# EAGLE schematic Controller-Board_Rack-PDU_2.0 (EAGLE 9.2.1)

## Sheet 1 of 2: MICROCONTROLLER
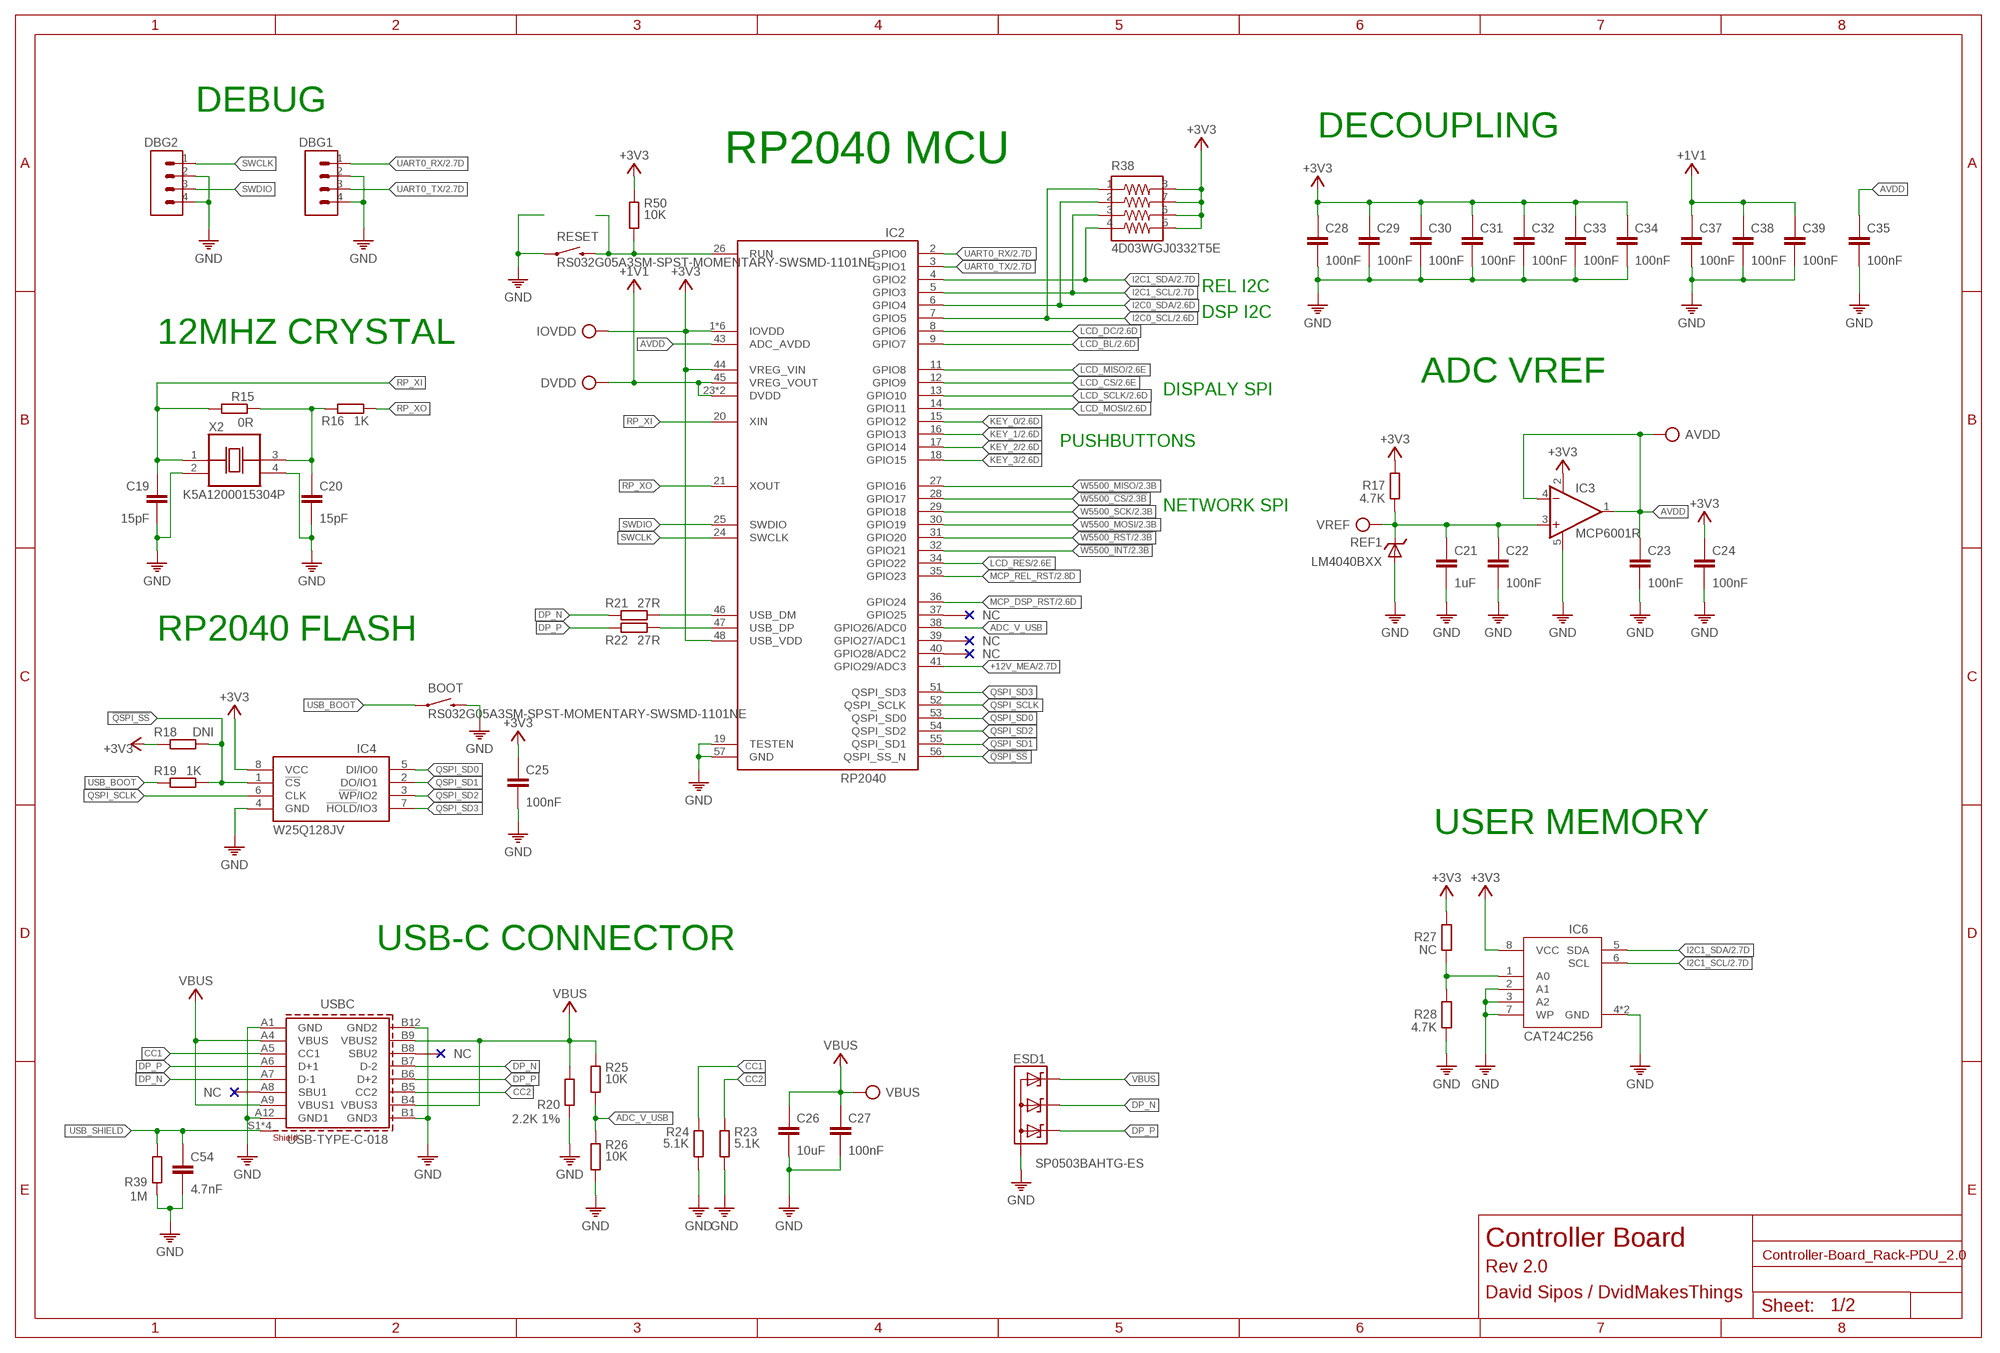
[diagram p0: schematic, sheet 1]

### Parts
AVDD  TP  [TP]
BOOT  RS032G05A3SM-SPST-MOMENTARY-SWSMD-1101NE  [TACTILE-SWITCH-1101NE]
C19  15pF  C-0402  [C0402]
C20  15pF  C-0402  [C0402]
C21  1uF  C-0402  [C0402]
C22  100nF  C-0402  [C0402]
C23  100nF  C-0402  [C0402]
C24  100nF  C-0402  [C0402]
C25  100nF  C-0402  [C0402]
C26  10uF  C0805  [0805]
C27  100nF  C0402  [0402]
C28  100nF  C-0402  [C0402]
C29  100nF  C-0402  [C0402]
C30  100nF  C-0402  [C0402]
C31  100nF  C-0402  [C0402]
C32  100nF  C-0402  [C0402]
C33  100nF  C-0402  [C0402]
C34  100nF  C-0402  [C0402]
C35  100nF  C-0402  [C0402]
C37  100nF  C-0402  [C0402]
C38  100nF  C-0402  [C0402]
C39  100nF  C-0402  [C0402]
C54  4.7nF  C0402  [0402]
DBG1  CON-1X4  [1X4]
DBG2  CON-1X4  [1X4]
DVDD  TP  [TP]
ESD1  SP0503BAHTG-ES  SP0503BAHT  [SOT143]
IC2  RP2040  [QFN40P700X700X100-57T510]
IC3  MCP6001R  MCP6001RT  [SOT23-5]
IC4  W25Q128JVPIQ  W25Q128JVP  [SON127P600X500X75-8N]
IC6  CAT24C512HU5IGT3  CAT24C256-HU4  [SON50P300X200X50-9T130X140N]
IOVDD  TP  [TP]
R15  0R  R0402  [0402]
R16  1K  R0402  [0402]
R17  4.7K  R0402  [0402]
R18  DNI  R0402  [0402]
R19  1K  R0402  [0402]
R20  2.2K 1%  R0402  [0402]
R21  27R  R0402  [0402]
R22  27R  R0402  [0402]
R23  5.1K  R0402  [0402]
R24  5.1K  R0402  [0402]
R25  10K  R0402  [0402]
R26  10K  R0402  [0402]
R27  NC  R0402  [0402]
R28  4.7K  R0402  [0402]
R38  4D03WGJ0332T5E  742C083103JP  [742C083103JP]
R39  1M  R0402  [0402]
R50  10K  R0402  [0402]
REF1  LM4040BXX  [SOT23]
RESET  RS032G05A3SM-SPST-MOMENTARY-SWSMD-1101NE  [TACTILE-SWITCH-1101NE]
USBC  USB-TYPE-C-018  629722000214  [629722000214]
VBUS  TP  [TP]
VREF  TP  [TP]
X2  K5A1200015304P  CRYSTAL  [OSCCC500X320X130]

### Nets
!QSPI_SS: IC2.56(QSPI_SS_N) IC4.1(!CS) R18.1 R19.2
!W5500_CS: IC2.28(GPIO17) ; also sheet 2
!W5500_INT: IC2.32(GPIO21) ; also sheet 2
!W5500_RST: IC2.31(GPIO20) ; also sheet 2
+1V1: C37.1 C38.1 C39.1 DVDD.TP IC2.23(DVDD) IC2.45(VREG_VOUT) IC2.50(DVDD)
+3V3: C24.1 C25.1 C28.1 C29.1 C30.1 C31.1 C32.1 C33.1 C34.1 IC2.1(IOVDD) IC2.10(IOVDD) IC2.22(IOVDD) IC2.33(IOVDD) IC2.42(IOVDD) IC2.44(VREG_VIN) IC2.48(USB_VDD) IC2.49(IOVDD) IC3.2(V+) IC4.8(VCC) IC6.8(VCC) IOVDD.TP R17.2 R18.2 R27.2 R38.5 R38.6 R38.7 R38.8 R50.1 ; also sheet 2
+12V_MEA: IC2.41(GPIO29/ADC3) ; also sheet 2
ADC_V_USB: IC2.38(GPIO26/ADC0) R25.2 R26.1
AVDD: AVDD.TP C23.1 C35.1 IC2.43(ADC_AVDD) IC3.1(OUT) IC3.4(-IN)
CC1: R24.1 USBC.A5(CC1)
CC2: R23.1 USBC.B5(CC2)
DP_N [90R_DIFFPAIR]: ESD1.3(C2) R21.1 USBC.A7(D-1) USBC.B7(D-2)
DP_P [90R_DIFFPAIR]: ESD1.2(C1) R22.1 USBC.A6(D+1) USBC.B6(D+2)
GND: BOOT.2 C19.2 C20.2 C21.2 C22.2 C23.2 C24.2 C25.2 C26.2 C27.2 C28.2 C29.2 C30.2 C31.2 C32.2 C33.2 C34.2 C35.2 C37.2 C38.2 C39.2 C54.2 DBG1.2 DBG1.4 DBG2.2 DBG2.4 ESD1.1(A) IC2.19(TESTEN) IC2.57(GND) IC3.5(V-) IC4.4(GND) IC6.2(A1) IC6.3(A2) IC6.4(GND) IC6.7(WP) IC6.9(GND) R20.2 R23.2 R24.2 R26.2 R28.1 R39.2 REF1.2(A) REF1.3(A) RESET.1 USBC.A1(GND) USBC.A12(GND1) USBC.B1(GND3) USBC.B12(GND2) X2.2(VSS) X2.4(VDD) ; also sheet 2
I2C0_SCL: IC2.7(GPIO5) R38.1 ; also sheet 2
I2C0_SDA: IC2.6(GPIO4) R38.2 ; also sheet 2
I2C1_SCL: IC2.5(GPIO3) IC6.6(SCL) R38.3 ; also sheet 2
I2C1_SDA: IC2.4(GPIO2) IC6.5(SDA) R38.4 ; also sheet 2
KEY_0: IC2.15(GPIO12) ; also sheet 2
KEY_1: IC2.16(GPIO13) ; also sheet 2
KEY_2: IC2.17(GPIO14) ; also sheet 2
KEY_3: IC2.18(GPIO15) ; also sheet 2
LCD_BL: IC2.9(GPIO7) ; also sheet 2
LCD_CS: IC2.12(GPIO9) ; also sheet 2
LCD_DC: IC2.8(GPIO6) ; also sheet 2
LCD_MISO: IC2.11(GPIO8) ; also sheet 2
LCD_MOSI: IC2.14(GPIO11) ; also sheet 2
LCD_RES: IC2.34(GPIO22) ; also sheet 2
LCD_SCLK: IC2.13(GPIO10) ; also sheet 2
MCP_DSP_RST: IC2.36(GPIO24) ; also sheet 2
MCP_REL_RST: IC2.35(GPIO23) ; also sheet 2
N$14: C20.1 R15.2 R16.1 X2.3(OUT)
N$17: IC2.26(RUN) R50.2 RESET.2
N$23: IC6.1(A0) R27.1 R28.2
QSPI_SCLK: IC2.52(QSPI_SCLK) IC4.6(CLK)
QSPI_SD0: IC2.53(QSPI_SD0) IC4.5(DI/IO0)
QSPI_SD1: IC2.55(QSPI_SD1) IC4.2(DO/IO1)
QSPI_SD2: IC2.54(QSPI_SD2) IC4.3(!WP!/IO2)
QSPI_SD3: IC2.51(QSPI_SD3) IC4.7(!HOLD!/IO3)
RP_XI: C19.1 IC2.20(XIN) R15.1 X2.1(CON)
RP_XO: IC2.21(XOUT) R16.2
SWCLK: DBG2.1 IC2.24(SWCLK)
SWDIO: DBG2.3 IC2.25(SWDIO)
UART0_RX: DBG1.1 IC2.2(GPIO0) ; also sheet 2
UART0_TX: DBG1.3 IC2.3(GPIO1) ; also sheet 2
USB_BOOT: BOOT.1 R19.1
USB_DP_N [90R_DIFFPAIR]: IC2.46(USB_DM) R21.2
USB_DP_P [90R_DIFFPAIR]: IC2.47(USB_DP) R22.2
USB_SHIELD: C54.1 R39.1 USBC.S1(SHIELD) USBC.S2(SHIELD) USBC.S3(SHIELD) USBC.S4(SHIELD)
VBUS: C26.1 C27.1 ESD1.4(C3) R20.1 R25.1 USBC.A4(VBUS) USBC.A9(VBUS1) USBC.B4(VBUS3) USBC.B9(VBUS2) VBUS.TP ; also sheet 2
VREF: C21.1 C22.1 IC3.3(+IN) R17.1 REF1.1(C) VREF.TP
W5500_MISO: IC2.27(GPIO16) ; also sheet 2
W5500_MOSI: IC2.30(GPIO19) ; also sheet 2
W5500_SCK: IC2.29(GPIO18) ; also sheet 2
Unconnected: IC2.37(GPIO25) IC2.39(GPIO27/ADC1) IC2.40(GPIO28/ADC2) USBC.A8(SBU1) USBC.B8(SBU2)

### Notes on the sheet
- DEBUG
- DECOUPLING
- RP2040 MCU
- REL I2C
- DSP I2C
- 12MHZ CRYSTAL
- ADC VREF
- DISPALY SPI
- PUSHBUTTONS
- NETWORK SPI
- RP2040 FLASH
- USER MEMORY
- USB-C CONNECTOR
- Controller Board
- Rev 2.0
- David Sipos / DvidMakesThings

## Sheet 2 of 2: NETWORK AND CONNECTORS
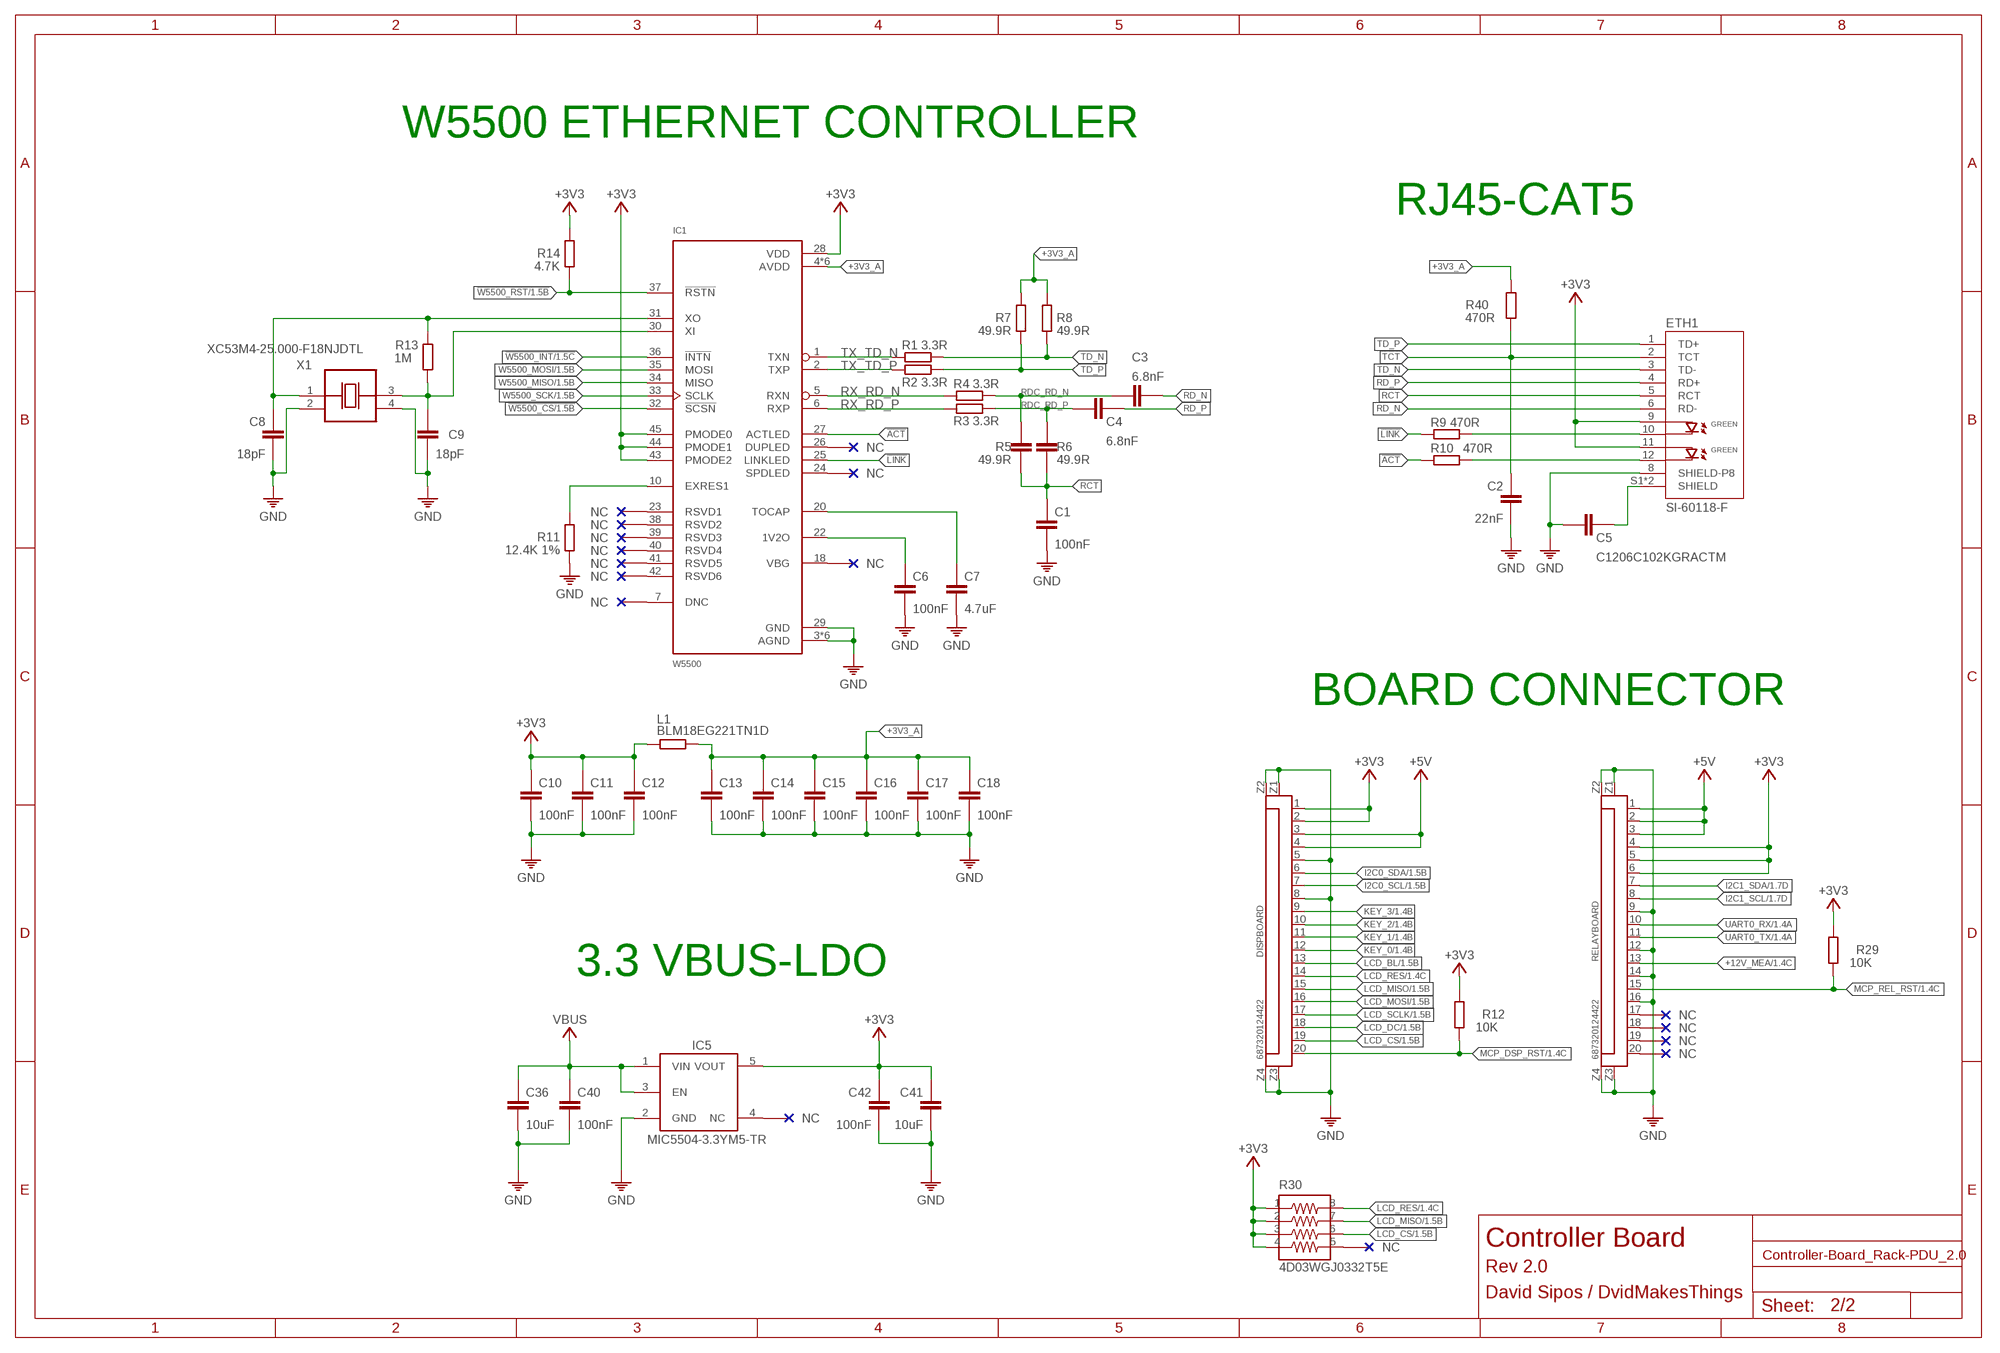
[diagram p1: schematic, sheet 2]

### Parts
C1  100nF  C-0402  [C0402]
C2  22nF  C-0402  [C0402]
C3  6.8nF  C-0402  [C0402]
C4  6.8nF  C-0402  [C0402]
C5  C1206C102KGRACTM  C-1206  [C1206]
C6  100nF  C-0402  [C0402]
C7  4.7uF  C-0402  [C0402]
C8  18pF  C-0402  [C0402]
C9  18pF  C-0402  [C0402]
C10  100nF  C-0402  [C0402]
C11  100nF  C-0402  [C0402]
C12  100nF  C-0402  [C0402]
C13  100nF  C-0402  [C0402]
C14  100nF  C-0402  [C0402]
C15  100nF  C-0402  [C0402]
C16  100nF  C-0402  [C0402]
C17  100nF  C-0402  [C0402]
C18  100nF  C-0402  [C0402]
C36  10uF  C0805  [0805]
C40  100nF  C0402  [0402]
C41  10uF  C0805  [0805]
C42  100nF  C0402  [0402]
DISPBOARD  687320124422  6873XX124422_687320124422  [687320124422]
ETH1  SI-60118-F  RJ45-CAT5  [RJ45-CAT5]
IC1  W5500  [LQFP48]
IC5  MIC5504-3.3YM5-TR  [SOT23-5]
L1  BLM18EG221TN1D  R0603  [0603]
R1  3.3R  R0402  [0402]
R2  3.3R  R0402  [0402]
R3  3.3R  R0402  [0402]
R4  3.3R  R0402  [0402]
R5  49.9R  C-0402  [C0402]
R6  49.9R  C-0402  [C0402]
R7  49.9R  R0402  [0402]
R8  49.9R  R0402  [0402]
R9  470R  R0402  [0402]
R10  470R  R0402  [0402]
R11  12.4K 1%  R0402  [0402]
R12  10K  R0402  [0402]
R13  1M  R0402  [0402]
R14  4.7K  R0402  [0402]
R29  10K  R0402  [0402]
R30  4D03WGJ0332T5E  742C083103JP  [742C083103JP]
R40  470R  R0402  [0402]
RELAYBOARD  687320124422  6873XX124422_687320124422  [687320124422]
X1  XC53M4-25.000-F18NJDTL  CRYSTAL  [OSCCC500X320X130]

### Nets
!ACT: IC1.27(ACTLED) R10.1
!LINK: IC1.25(LINKLED) R9.1
!W5500_CS: IC1.32(!SCSN) ; also sheet 1
!W5500_INT: IC1.36(!INTN) ; also sheet 1
!W5500_RST: IC1.37(!RSTN) R14.1 ; also sheet 1
+3V3: C10.1 C11.1 C12.1 C41.1 C42.1 DISPBOARD.1 DISPBOARD.2 ETH1.9(GA1) ETH1.11(GA2) IC1.28(VDD) IC1.43(PMODE2) IC1.44(PMODE1) IC1.45(PMODE0) IC5.5(VOUT) L1.1 R12.2 R14.2 R29.2 R30.1 R30.2 R30.3 R30.4 RELAYBOARD.4 RELAYBOARD.5 RELAYBOARD.6 ; also sheet 1
+3V3_A: C13.1 C14.1 C15.1 C16.1 C17.1 C18.1 IC1.4(AVDD) IC1.8(AVDD) IC1.11(AVDD) IC1.15(AVDD) IC1.17(AVDD) IC1.21(AVDD) L1.2 R7.2 R8.2 R40.2
+5V: DISPBOARD.3 DISPBOARD.4 RELAYBOARD.1 RELAYBOARD.2 RELAYBOARD.3
+12V_MEA: RELAYBOARD.13 ; also sheet 1
CHASSIS: C5.2 ETH1.S1(SHIELD) ETH1.S2(SHIELD)
GND: C1.2 C2.2 C5.1 C6.2 C7.2 C8.2 C9.2 C10.2 C11.2 C12.2 C13.2 C14.2 C15.2 C16.2 C17.2 C18.2 C36.2 C40.2 C41.2 C42.2 DISPBOARD.5 DISPBOARD.8 DISPBOARD.Z1 DISPBOARD.Z2 DISPBOARD.Z3 DISPBOARD.Z4 ETH1.8(SHIELD-P8) IC1.3(AGND) IC1.9(AGND) IC1.14(AGND) IC1.16(AGND) IC1.19(AGND) IC1.29(GND) IC1.48(AGND) IC5.2(GND) R11.1 RELAYBOARD.9 RELAYBOARD.12 RELAYBOARD.14 RELAYBOARD.16 RELAYBOARD.Z1 RELAYBOARD.Z2 RELAYBOARD.Z3 RELAYBOARD.Z4 X1.2(VSS) X1.4(VDD) ; also sheet 1
I2C0_SCL: DISPBOARD.7 ; also sheet 1
I2C0_SDA: DISPBOARD.6 ; also sheet 1
I2C1_SCL: RELAYBOARD.8 ; also sheet 1
I2C1_SDA: RELAYBOARD.7 ; also sheet 1
KEY_0: DISPBOARD.12 ; also sheet 1
KEY_1: DISPBOARD.11 ; also sheet 1
KEY_2: DISPBOARD.10 ; also sheet 1
KEY_3: DISPBOARD.9 ; also sheet 1
LCD_BL: DISPBOARD.13 ; also sheet 1
LCD_CS: DISPBOARD.19 R30.6 ; also sheet 1
LCD_DC: DISPBOARD.18 ; also sheet 1
LCD_MISO: DISPBOARD.15 R30.7 ; also sheet 1
LCD_MOSI: DISPBOARD.16 ; also sheet 1
LCD_RES: DISPBOARD.14 R30.8 ; also sheet 1
LCD_SCLK: DISPBOARD.17 ; also sheet 1
MCP_DSP_RST: DISPBOARD.20 R12.1 ; also sheet 1
MCP_REL_RST: R29.1 RELAYBOARD.15 ; also sheet 1
N$1: IC1.10(EXRES1) R11.2
N$2: ETH1.10(GK1) R9.2
N$3: ETH1.12(GK2) R10.2
N$4: C6.1 IC1.22(1V2O)
N$5: C7.1 IC1.20(TOCAP)
N$7: C9.1 IC1.30(XI) R13.1 X1.3(OUT)
RCT: C1.1 ETH1.5(RCT) R5.1 R6.1
RD_N [100R_DIFFPAIR]: C3.2 ETH1.6(RD-)
RD_P [100R_DIFFPAIR]: C4.2 ETH1.4(RD+)
RDC_RD_N [100R_DIFFPAIR]: C3.1 R4.2 R5.2
RDC_RD_P [100R_DIFFPAIR]: C4.1 R3.2 R6.2
RX_RD_N [100R_DIFFPAIR]: IC1.5(RXN) R4.1
RX_RD_P [100R_DIFFPAIR]: IC1.6(RXP) R3.1
TCT: C2.1 ETH1.2(TCT) R40.1
TD_N [100R_DIFFPAIR]: ETH1.3(TD-) R1.2 R8.1
TD_P [100R_DIFFPAIR]: ETH1.1(TD+) R2.2 R7.1
TX_TD_N [100R_DIFFPAIR]: IC1.1(TXN) R1.1
TX_TD_P [100R_DIFFPAIR]: IC1.2(TXP) R2.1
UART0_RX: RELAYBOARD.10 ; also sheet 1
UART0_TX: RELAYBOARD.11 ; also sheet 1
VBUS: C36.1 C40.1 IC5.1(VIN) IC5.3(EN) ; also sheet 1
W5500_MISO: IC1.34(MISO) ; also sheet 1
W5500_MOSI: IC1.35(MOSI) ; also sheet 1
W5500_SCK: IC1.33(SCLK) ; also sheet 1
XO: C8.1 IC1.31(XO) R13.2 X1.1(CON)
Unconnected: IC1.7(DNC) IC1.18(VBG) IC1.23(RSVD1) IC1.24(SPDLED) IC1.26(DUPLED) IC1.38(RSVD2) IC1.39(RSVD3) IC1.40(RSVD4) IC1.41(RSVD5) IC1.42(RSVD6) IC5.4(NC) R30.5 RELAYBOARD.17 RELAYBOARD.18 RELAYBOARD.19 RELAYBOARD.20

### Notes on the sheet
- W5500 ETHERNET CONTROLLER
- RJ45-CAT5
- BOARD CONNECTOR
- 3.3 VBUS-LDO
- Controller Board
- Rev 2.0
- David Sipos / DvidMakesThings

## Library data of the parts
AVDD DVDD IOVDD VBUS VREF = ds_passive:TP
BOOT RESET = BeagleBone_Blue_R3:RS032G05A3SM-SPST-MOMENTARY-SW: 6x3.5mm 2-pin Momentary Switch (Push-button) Digikey Link <https://www.digikey.com/products/en?keywords=CKN10388TR-ND> Datasheet <https://media.digikey.com/pdf/Data%20Sheets/C&K/RS-032G05_-SM_RT.pdf>; PROD_ID: SWCH-00815
C1-C42 C54 R5 R6 = ds_passive:C
DBG1 DBG2 = ds_con:CON-1X4
DISPBOARD RELAYBOARD = Wurth_Connectors_WR-FPC:6873XX124422_687320124422: WR-FPC 0.50 mm SMT ZIF Vertical KIND PROPERTIES Pitch 0.5 mm MATERIAL PROPERTIES Insulator Material LCP Contact Material Phosphor Bronze Contact Plating 100 (µ") Tin over 50 (µ") Nickel Contact Type Stamped Solder Tabs Brass <https://www.we-online.com/catalog/media/o32874v209%20Family_WE-FPC_6873xx124422.jpg> Details see: https://www.we-online.com/catalog/en/FPC_0_5_SMT_ZIF_VERTICAL_6873XX124422/ Updated by Ella Wu 2020-08-26 2020(C) Wurth Elektronik; CONTACT-RESISTANCE: 20mOhm; DATASHEET-URL: https://www.we-online.com/redexpert/spec/687320124422?ae; IR: 0.5A; L: 16.4mm; PACKAGING: Tape and Reel with Cap; PART-NUMBER: 687320124422; PINS: 20; PITCH: 0.5mm; TYPE: Vertical; WORKING-VOLTAGE: 50V(AC)
ESD1 = ds_ic_peripherals:SP0503BAHT: TVS Diode Arrays Surface Mount TVS Avalanche Diode Array
ETH1 = ds_con:RJ45-CAT5; MANUFACTURER: Bel Fuse; MAXIMUM_PACKAGE_HEIGHT: 15.21mm; PARTREV: A0; STANDARD: Manufacturer Recommendations
IC1 = ds_ic_peripherals:W5500: The W5500 chip is a Hardwired TCP/IP embedded Ethernet controller that provides easier Internet connection to embedded systems. W5500 enables users to have the Internet connectivity in their applications just by using the single chip in which TCP/IP stack, 10/100 Ethernet MAC and PHY embedded. WIZnet‘s Hardwired TCP/IP is the market-proven technology that supports TCP, UDP, IPv4, ICMP, ARP, IGMP, and PPPoE protocols. W5500 embeds the 32Kbyte internal memory buffer for the Ethernet packet processing. If you use W5500, you can implement the Ethernet application just by adding the simple socket program. It’s faster and easier way rather than using any other Embedded Ethernet solution. Users can use 8 independent hardware sockets simultaneously. SPI (Serial Peripheral Interface) is provided for easy integration with the external MCU. The W5500’s SPI supports 80 MHz speed and new efficient SPI protocol for the high speed network communication. In order to reduce power consumption of the system, W5500 provides WOL (Wake on LAN) and power down mode.
IC2 = ds_ic_mcu:RP2040
IC3 = ds_ic_opa:MCP6001RT: 1 MHz, Low-Power Op Amp
IC4 = MCU:W25Q128JV: 3V 128M-BIT SERIAL FLASH MEMORY WITH DUAL/QUAD SPI & QPI & DTR
IC5 = ds_ic_vreg:MIC5504-3.3YM5-TR: The MIC5501/2/3/4 is an advanced general-purpose LDO ideal for powering general-purpose portable devices. The MIC5501/2/3/4 family of products provides a high-performance 300mA LDO
IC6 = ds_ic_memory:CAT24C256: The CAT24C256 is a EEPROM Serial 256−Kb I2C, internally organized as 32,768 words of 8 bits each. It features a 64−byte page write buffer and supports the Standard (100 kHz), Fast (400 kHz) and Fast−Plus (1 MHz) I2C protocol. Write operations can be inhibited by taking the WP pin High (this protects the entire memory). External address pins make it possible to address up to eight CAT24C256 devices on the same bus. On−Chip ECC (Error Correction Code) makes the device suitable for high reliability applications.
L1 R1-R4 R7-R29 R39 R40 R50 = ds_passive:R
R30 R38 = Resistor Array:742C083103JP: RES ARRAY 4 RES 10K OHM 1206 Manufacturer's datasheet <https://www.ctscorp.com/wp-content/uploads/74x.pdf>; CREATED_BY: PCBLayout.com; DIGIKEY_PN: 742C083103JPTR-ND; MANUFACTURER: CTS Resistor Products; MPN: 742C083103JP; PACKAGE: 1206
REF1 = ds_ic_vreg:LM4040BXX: Fixed voltage, 45-µA, precision micropower shunt voltage reference
USBC = Wurth_Connectors_WR-USB:629722000214: WR-COM USB 2.0 Type C Receptacle Horizontal SMT Kind Properties Durability 10 000 Mating cycles Gender Receptacle Type Horizontal General Information Operating Temperature -40 up to +85 °C Electrical Properties Working Voltage 20 V (DC) Withstanding Voltage 100 V (AC) Contact Resistance 40 mΩ Material Properties Insulator Material LCP Insulator Flammability Rating UL94 V-0 Insulator Color Black Contact Material Brass Contact Plating Gold over Nickel Contact Type Stamped Shielding Material Steel Shielding Plating Nickel (Ni) <https://www.we-online.com/components/media/o689297v209%20family-wr-com-629722000214.jpg> Details see: www.we-online.com/en/components/products/WR-COM_USB_20_TYPE_C_RECEPTACLE_HORIZONTAL_SMT <www.we-online.com/catalog/WR-COM_USB_20_TYPE_C_RECEPTACLE_HORIZONTAL_SMT/?utm_source=eagle_model&utm_medium=description_link&utm_campaign=eisos_eagle> Updated by Ella Wu 2023-05-30 2023 (C) Würth Elektronik; APPLICATION: USB 2.0; DATASHEET-URL: https://www.we-online.com/redexpert/spec/629722000214?ae; GERDER: Receptacle; INTERFACE-TYPE: Type C; IR: 5A; MOUNT: SMT; PACKAGING: Tape and Reel; PART-NUMBER: 629722000214; PINS: 16; TYPE: Horizontal; VALUE: 629722000214; WORKING-VOLTAGE: 20V(AC)
X1 X2 = ds_passive:CRYSTAL

## Net classes
0 default: width 0.2 mm, drill 0.15 mm, clearance 0.178 mm
1 100R_DIFFPAIR: width 0.121 mm, drill 0.15 mm, clearance 0.191 mm
2 90R_DIFFPAIR: width 0.155 mm, drill 0.15 mm, clearance 0.191 mm